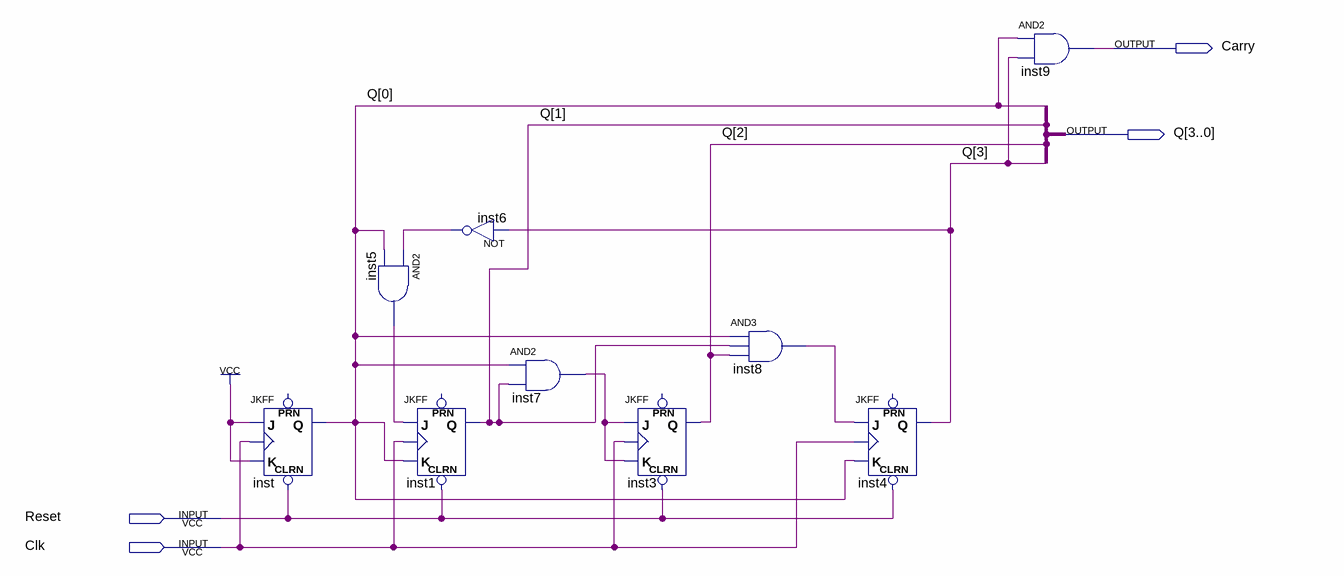
[diagram p0: schematic sheet]
// Quartus schematic Numarator_V2.bdf as structural Verilog: 9 symbols, 4 pins
module Numarator_V2 (
  input  Reset,
  input  Clk,
  output Carry,
  output [3:0] Q
);

  wire inst5_out, inst6_out, inst7_out, inst8_out;

  JKFF inst (.CLRN(Reset), .K(1'b1), .J(1'b1), .CLK(Clk), .Q(Q[0]));  // open: PRN
  and inst5 (inst5_out, inst6_out, Q[0]);
  not inst6 (inst6_out, Q[3]);
  JKFF inst1 (.CLRN(Reset), .K(Q[0]), .J(inst5_out), .CLK(Clk), .Q(Q[1]));  // open: PRN
  and inst7 (inst7_out, Q[0], Q[1]);
  JKFF inst3 (.CLRN(Reset), .K(inst7_out), .J(inst7_out), .CLK(Clk), .Q(Q[2]));  // open: PRN
  and inst8 (inst8_out, Q[0], Q[1], Q[2]);
  JKFF inst4 (.CLRN(Reset), .K(Q[0]), .J(inst8_out), .CLK(Clk), .Q(Q[3]));  // open: PRN
  and inst9 (Carry, Q[0], Q[3]);
endmodule
